# Altium schematic sheet POWER_NODE.SchDoc
size A3; SheetNumber: 3; SheetTotal: 3
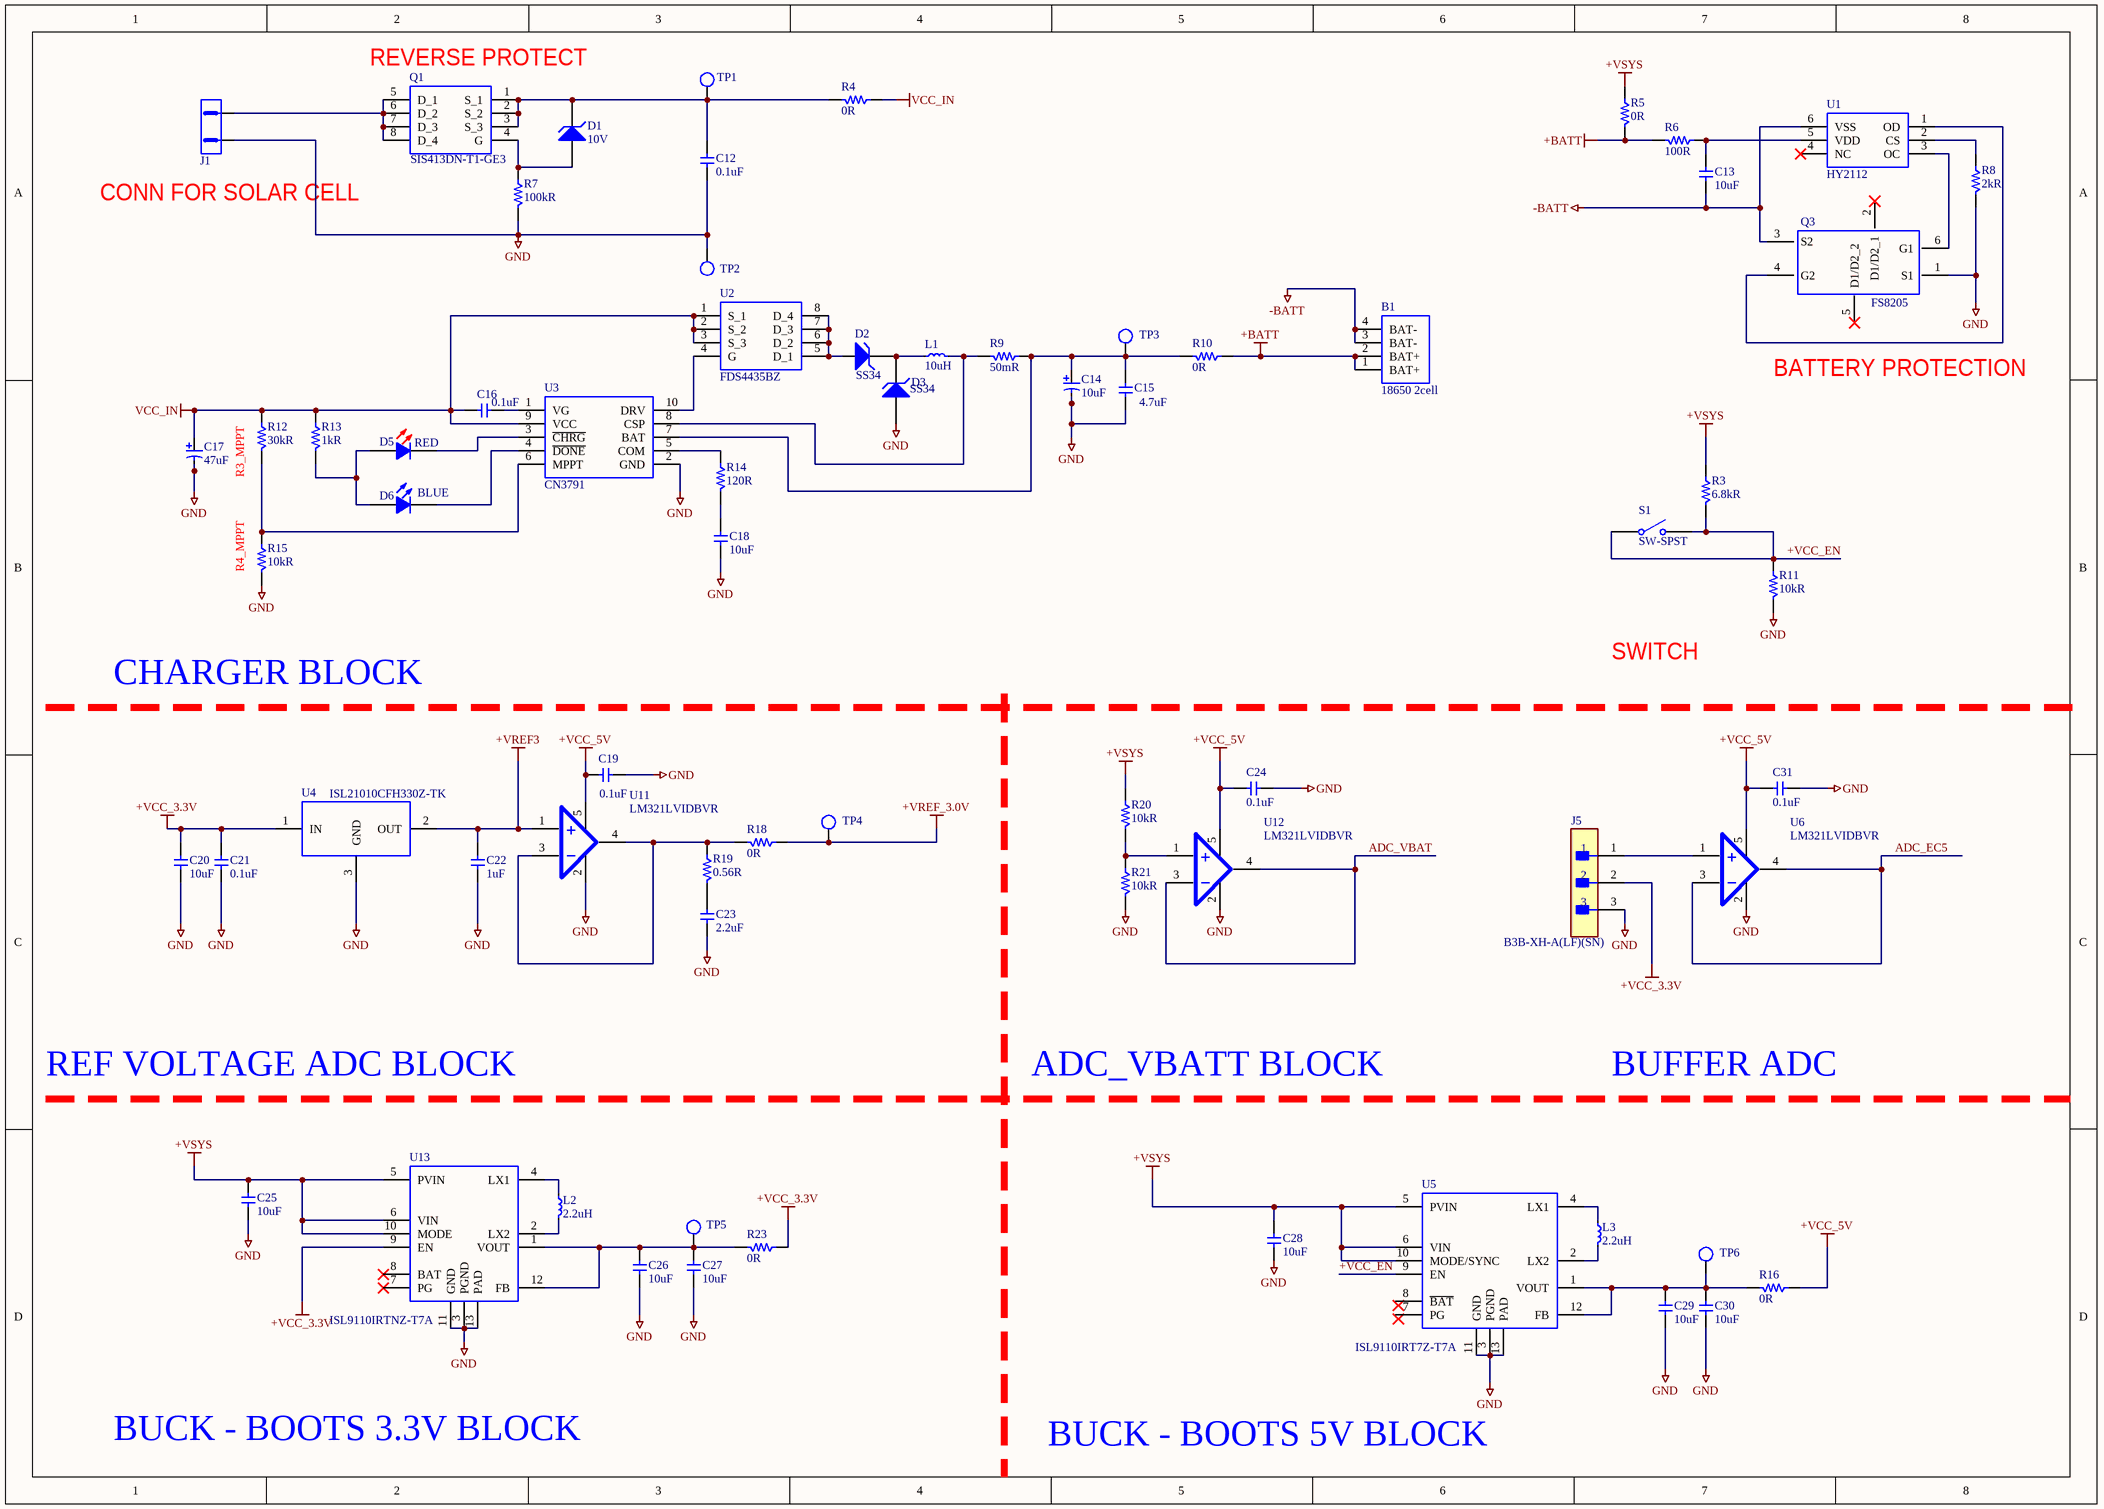
[diagram p0: POWER_NODE.SchDoc]

## Parts
B1  18650 2cell  [18650 2CELL]
C12  0.1uF  [CAP 0402 (1005)]
C13  10uF  [CAP 0603 (1608)]
C14  10uF  [CAP 1206 TANTALUM]
C15  4.7uF  [CAP 0402 (1005)]
C16  0.1uF  [CAP 0402 (1005)]
C17  47uF  [CAP ALUMIUM 47uF]
C18  10uF  [CAP 0603 (1608)]
C19  0.1uF  [CAP 0402 (1005)]
C20  10uF  [CAP 0603 (1608)]
C21  0.1uF  [CAP 0402 (1005)]
C22  1uF  [CAP 0402 (1005)]
C23  2.2uF  [CAP 0402 (1005)]
C24  0.1uF  [CAP 0402 (1005)]
C25  10uF  [CAP 0603 (1608)]
C26  10uF  [CAP 0603 (1608)]
C27  10uF  [CAP 0603 (1608)]
C28  10uF  [CAP 0603 (1608)]
C29  10uF  [CAP 0603 (1608)]
C30  10uF  [CAP 0603 (1608)]
C31  0.1uF  [CAP 0402 (1005)]
D1  10V  [SOT-323]
D2  SS34  [DIOM8059X256N]
D3  SS34  [DIOM8059X256N]
D5  RED  [LED 0402 RED]
D6  BLUE  [LED0402 BLUE]
J1  CONN  [HEADER 2P 2.54MM ANGLE RIGHT]  (value not drawn)
J5  B3B-XH-A(LF)(SN)  [FP-B3B-XH-A_LF_SN-MFG]
L1  10uH  [IND 10uH 4x4x2mm]
L2  2.2uH  [IND 4028]
L3  2.2uH  [IND 4028]
Q1  SIS413DN-T1-GE3  [SIS862DNT1GE3]
Q3  FS8205  [SOT95P280X125-6N]
R3  6.8kR  [RES 0402 (1005)]
R4  0R  [RES 0603 (1608)]
R5  0R  [RES 0603 (1608)]
R6  100R  [RES 0402 (1005)]
R7  100kR  [RES 0402 (1005)]
R8  2kR  [RES 0402 (1005)]
R9  50mR  [RES 0805 (2012)]
R10  0R  [RES 0603 (1608)]
R11  10kR  [RES 0402 (1005)]
R12  30kR  [RES 0402 (1005)]
R13  1kR  [RES 0402 (1005)]
R14  120R  [RES 0402 (1005)]
R15  10kR  [RES 0402 (1005)]
R16  0R  [RES 0603 (1608)]
R18  0R  [RES 0402 (1005)]
R19  0.56R  [RES 0402 (1005)]
R20  10kR  [RES 0402 (1005)]
R21  10kR  [RES 0402 (1005)]
R23  0R  [RES 0603 (1608)]
S1  SW-SPST  [SW_SS12D07VG4]
TP1  TEST POINT  [TEST POINT]  (value not drawn)
TP2  TEST POINT  [TEST POINT]  (value not drawn)
TP3  TEST POINT  [TEST POINT]  (value not drawn)
TP4  TEST POINT  [TEST POINT]  (value not drawn)
TP5  TEST POINT  [TEST POINT]  (value not drawn)
TP6  TEST POINT  [TEST POINT]  (value not drawn)
U1  HY2112  [SOT95P280X140-6N]
U2  FDS4435BZ  [SOIC127P600X175-8N]
U3  CN3791  [SOP100P600X175-10N]
U4  ISL21010CFH330Z-TK  [SOT-23-3]
U5  ISL9110IRT7Z-T7A  [12-WFDFN EXPOSED PAD]
U6  LM321LVIDBVR  [SOT-23-5]
U11  LM321LVIDBVR  [SOT-23-5]
U12  LM321LVIDBVR  [SOT-23-5]
U13  ISL9110IRTNZ-T7A  [12-WFDFN EXPOSED PAD]

## Nets
+BATT: B1.1(BAT+) B1.2(BAT+) R5.1 R6.1 R10.2
+VCC_3.3V: C20.1 C21.1 J5.2 R23.2 U4.1(IN) U13.9(EN)
+VCC_5V: C19.1 C24.1 C31.1 R16.2 U6.5 U11.5 U12.5
+VREF3: C22.1 U4.2(OUT) U11.1
+VREF_3.0V: R18.2 TP4.1
+VSYS: C25.1 C28.1 R3.2 R5.2 R20.2 U5.5(PVIN) U5.6(VIN) U5.10(MODE/SYNC) U13.5(PVIN) U13.6(VIN) U13.10(MODE)
-BATT: B1.3(BAT-) B1.4(BAT-) C13.2 Q3.3(S2) U1.6(VSS)
GND: C12.2 C14.2(-) C15.2 C17.2(-) C18.2 C19.2 C20.2 C21.2 C22.2 C23.2 C24.2 C25.2 C26.2 C27.2 C28.2 C29.2 C30.2 C31.2 D3.2(A) J1.2 J5.3 Q3.1(S1) R7.1 R8.1 R11.1 R15.1 R21.1 TP2.1 U3.2(GND) U4.3(GND) U5.3(PGND) U5.11(GND) U5.13(PAD) U6.2 U11.2 U12.2 U13.3(PGND) U13.11(GND) U13.13(PAD)
VCC_IN: C16.2 C17.1(+) R4.2 R12.2 R13.2 U2.1(S_1) U2.2(S_2) U2.3(S_3) U3.9(VCC)
+VCC_EN: R3.1 R11.2 S1.1(COMMON) S1.2(NO) U5.9(EN)
ADC_EC5: U6.3 U6.4
ADC_VBAT: U12.3 U12.4
NetC12_1: C12.1 D1.1(K) Q1.1(S_1) Q1.2(S_2) Q1.3(S_3) R4.1 TP1.1
NetC13_1: C13.1 R6.2 U1.5(VDD)
NetC14_1: C14.1(+) C15.1 R9.2 R10.1 TP3.1 U3.7(BAT)
NetC16_1: C16.1 U3.1(VG)
NetC18_1: C18.1 R14.1
NetC23_1: C23.1 R19.1
NetC26_1: C26.1 C27.1 R23.1 TP5.1 U13.1(VOUT) U13.12(FB)
NetC29_1: C29.1 C30.1 R16.1 TP6.1 U5.1(VOUT) U5.12(FB)
NetD1_2: D1.2(A) Q1.4(G) R7.2
NetD2_1: D2.1(K) D3.1(K) L1.1
NetD2_2: D2.2(A) U2.5(D_1) U2.6(D_2) U2.7(D_3) U2.8(D_4)
NetD5_1: D5.1(A) D6.1(A) R13.1
NetD5_2: D5.2(K) U3.3(~{CHRG})
NetD6_2: D6.2(K) U3.4(~{DONE})
NetJ1_1: J1.1 Q1.5(D_1) Q1.6(D_2) Q1.7(D_3) Q1.8(D_4)
NetJ5_1: J5.1 U6.1
NetL1_2: L1.2 R9.1 U3.8(CSP)
NetL2_1: L2.1 U13.4(LX1)
NetL2_2: L2.2 U13.2(LX2)
NetL3_1: L3.1 U5.4(LX1)
NetL3_2: L3.2 U5.2(LX2)
NetQ3_4: Q3.4(G2) U1.1(OD)
NetQ3_6: Q3.6(G1) U1.3(OC)
NetR8_2: R8.2 U1.2(CS)
NetR12_1: R12.1 R15.2 U3.6(MPPT)
NetR14_2: R14.2 U3.5(COM)
NetR18_1: R18.1 R19.2 U11.3 U11.4
NetR20_1: R20.1 R21.2 U12.1
NetU2_4: U2.4(G) U3.10(DRV)

Not connected (* = marked no-connect by the designer): Q3 2(D1/D2_1)* 5(D1/D2_2)*; U1 4(NC)*; U5 7(PG) 8(~{BAT}); U13 7(PG)* 8(BAT)*

## Notes on the sheet
- (near Q1) REVERSE PROTECT
- (near J1) CONN FOR SOLAR CELL
- BATTERY PROTECTION
- (near R12) R3_MPPT
- (near R15) R4_MPPT
- CHARGER BLOCK
- SWITCH
- REF VOLTAGE ADC BLOCK
- ADC_VBATT BLOCK
- BUFFER ADC
- BUCK - BOOTS 3.3V BLOCK
- BUCK - BOOTS 5V BLOCK

## Library data of the parts
B1 = 18650 2CELL: BATTERY HOLDER; Manufacturer: CXT; Manufacturer Part Number: T220213; Supplier: CXT; Unit Price: 9.000VND
C12 C16 C19 C21 C24 C31 = CAP0402 0.1uF 50V: 50V 100nF ±10% 0402 Multilayer Ceramic Capacitors MLCC - SMD/SMT ROHS; Manufacturer: Samwha Capacitor; Manufacturer Part Number: CS1005X7R104K500NR; Supplier: LCSC electronics; Unit Price: $0.0017
C13 C18 C20 C25-C30 = CAP0603 10uF 25V: 25V 10uF X5R ±20% 0603 Multilayer Ceramic Capacitors MLCC - SMD/SMT ROHS; Manufacturer: Chinocera; Manufacturer Part Number: HGC0603R5106M250NTHJ; Supplier: LCSC electronics; Unit Price: $0.0199
C14 = CAP1206 TANTALUM 10uF: 10uF 20V 150mΩ@100kHz ±20% 1206 Tantalum Capacitors ROHS; Manufacturer: Kyocera AVX; Manufacturer Part Number: TCJA106M020R0150; Supplier: LCSC electronics; Unit Price: $0.4964
C15 = CAP0402 4.7uF 25V: 25V 4.7uF X5R 0402 Multilayer Ceramic Capacitors MLCC - SMD/SMT ROHS; Manufacturer: Murata Electronics; Manufacturer Part Number: GRM155R61E475ME15D; Supplier: LCSC electronics; Unit Price: $0.0433
C17 = CAP ALUMI 47uF 16V: 47uF 16V 31mA@120Hz ±20% SMD,D5xL5.4mm Aluminum Electrolytic Capacitors - SMD ROHS; Manufacturer: KNSCHA; Manufacturer Part Number: RST47UF16V034; Supplier: LCSC electronics; Unit Price: $0.0250
C22 = CAP0402 1uF 25V: 25V 1uF ±10% 0402 Multilayer Ceramic Capacitors MLCC - SMD/SMT ROHS; Manufacturer: FH (Guangdong Fenghua Advanced Tech); Manufacturer Part Number: 0402X105K250NT; Supplier: LCSC electronics; Unit Price: US$ 0.0044
C23 = CAP0402 2.2uF 25V: 25V 2.2uF ±20% 0402 Multilayer Ceramic Capacitors MLCC - SMD/SMT ROHS; Manufacturer: SANYEAR; Manufacturer Part Number: C0402X5R225M250NT; Supplier: LCSC electronics; Unit Price: $0.0166
D1 = BAT60B: Schottky Diode10V Single 600mV@1A 3A SOD-323 Schottky Barrier Diodes (SBD) ROHS; Manufacturer: High Diode; Manufacturer Part Number: BAT60B; Supplier: LCSC electronics; Unit Price: $0.0317
D2 D3 = SS34: 40V Single 0.55V@3.0A 3A SMA Schottky Barrier Diodes (SBD) ROHS; Manufacturer: onsemi; Manufacturer Part Number: SS34; Supplier: LCSC electronics; Unit Price: $0.0242
D5 = LED RED 0402: Red 0402 Light Emitting Diodes (LED) ROHS; Manufacturer: BrtLed(Bright LED Elec); Manufacturer Part Number: BL-HUB37A-AV-TRB; Supplier: LCSD electronics; Unit Price: $0.0171
D6 = LED BLUE 0402: blue 0402 Light Emitting Diodes (LED) ROHS; Manufacturer: BrtLed(Bright LED Elec); Manufacturer Part Number: BL-HB337A-AV-TRB; Supplier: LCSD electronics; Unit Price: $0.0178
J1 = CONN 2P 2.54mm THANG: 1x2P 1 XH/EH Tinning 2.54mm 2.54mm Female 2 -25℃~+85℃ Brass 3A Plug-in Plugin,P=2.5mm Wire To Board / Wire To Wire Connector ROHS; Manufacturer: SHOU HAN; Manufacturer Part Number: 2.54mm-2P ZZ; Supplier: LCSD electronics; Unit Price: $0.0069
J5 = CMP-17439-000014-3: CONN HEADER VERT 3POS 2.5MM; Max Voltage Rating (DC): 250V; Number of Positions: 3; Current Rating: 3A; Gender: Male; Wire/Cable Gauge: 22AWG; Contact Resistance: 20mR; Insulation Resistance: 1GR; Insulation Material: Nylon; Contact Plating: Tin; Depth: 5.75mm; Contact Type: Male Pin; Max Operating Temperature: 85°C; Insulation Color: Natural; Voltage Rating (AC): 250V; Color: Natural; Connector Type: Header; Orientation: Straight; Fastening Type: Detent; Housing Color: White; Min Operating Temperature: -25°C; Termination: Solder; Voltage Rating: 250V; Series: XH; Pitch: 2.5mm; Contact Shape: Square; Number of Rows: 1; Lead Free: Lead Free; Packaging: Bulk; Mount: Through Hole; Flammability Rating: UL94 V-0; Max Voltage Rating (AC): 250V; REACH SVHC: No SVHC; Housing Material: Polyamide; Contact Material: Brass; Lead Pitch: 2.5mm; Contact Finish - Mating: TIN; Length: 9.9mm; Max Current Rating: 3A; Number of Contacts: 3
L1 = IND 10uH: 10uH ±20% SMD,4x4x2mm Power Inductors ROHS; Manufacturer: SXN(Shun Xiang Nuo Elec); Manufacturer Part Number: SMNR4020-10UH; Supplier: LCSC electronics; Unit Price: $0.0639
L2 L3 = IND 2.2uH: 2.2uH Magnetic inductor 20% 1.22A SMD,3x3mm Power Inductors ROHS; Manufacturer: APV; Manufacturer Part Number: ANR3012T2R2M; Supplier: LCSC electronics; Unit Price: $0.0390
Q1 = SIS413DN-T1-GE3: MOSFET (P-Channel); Manufacturer: Vishay; Supplier: Digikey; Manufacturer Part Number: SIS413DN-T1-GE3; Unit Price: $0.57
Q3 = FET 2N FS8205: 20V 6A 28mΩ@4.5V,4A 1W 2 N-Channel SOT-23-6 MOSFETs ROHS; Manufacturer: Fortune Semicon; Manufacturer Part Number: FS8205; Supplier: LCSD electronics; Unit Price: $0.1805
R3 = RES0402 6.8kR 1%: ±1% 6.8kΩ 0402 Chip Resistor - Surface Mount ROHS; Manufacturer: VO; Manufacturer Part Number: SCR0402F6K8; Supplier: LCSC electronics; Unit Price: $0.0005
R4 R5 R10 R16 R23 = RES0603 0R: 0Ω 0603 Chip Resistor - Surface Mount ROHS; Manufacturer: KOA Speer Elec; Manufacturer Part Number: RK73Z1JTTD; Supplier: LCSC electronics; Unit Price: $0.0048
R6 = RES0402 100R 1%: ±1% 100Ω 0402 Chip Resistor - Surface Mount ROHS; Manufacturer: VO; Manufacturer Part Number: SCR0402F100R; Supplier: LCSC electronics; Unit Price: $0.0005
R7 = RES0402 100k 1%: ±1% 100kΩ 0402 Chip Resistor - Surface Mount ROHS; Manufacturer: VO; Manufacturer Part Number: SCR0402F100K; Supplier: LCSC electronics; Unit Price: $0.0005
R8 = RES0402 2kR 1%: ±1% 2kΩ 0402 Chip Resistor - Surface Mount ROHS; Manufacturer: VO; Manufacturer Part Number: SCR0402F2K; Supplier: LCSC electronics; Unit Price: $0.0005
R9 = RES0805 50mR Current Sense: 50mΩ ±1% 0805 Current Sense Resistors/Shunt Resistors ROHS; Manufacturer: TA-I Tech; Manufacturer Part Number: RL10FTNR050; Supplier: LCSC electronics; Unit Price: $0.0152
R11 = RES0402 10kR 1%: ±1% 10kΩ 0402 Chip Resistor - Surface Mount ROHS; Manufacturer: VO; Manufacturer Part Number: SCR0402F10K; Supplier: LCSC electronics; Unit Price: $0.0005
R12 = RES0402 47kR 1%: ±1% 47kΩ 0402 Chip Resistor - Surface Mount ROHS; Manufacturer: VO; Manufacturer Part Number: SCR0402F47K; Supplier: LCSC electronics; Unit Price: $0.0005
R13 = RES0402 1kR 1%: ±5% 1kΩ 0402 Chip Resistor - Surface Mount ROHS; Manufacturer: VO; Manufacturer Part Number: SCR0402J1K; Supplier: LCSC electronics; Unit Price: $0.0004
R14 = RES0402 120R 1%: ±1% 120Ω 0402 Chip Resistor - Surface Mount ROHS; Manufacturer: VO; Manufacturer Part Number: SCR0402F120R; Supplier: LCSC electronics; Unit Price: $0.0005
R15 = RES0402 12kR 1%: ±1% 12kΩ 0402 Chip Resistor - Surface Mount ROHS; Manufacturer: VO; Manufacturer Part Number: SCR0402F12K; Supplier: LCSC electronics; Unit Price: $0.0005
R18 = RES0402 0R: 0Ω 0402 Chip Resistor - Surface Mount ROHS; Manufacturer: KOA Speer Elec; Manufacturer Part Number: RK73Z1ETTP; Supplier: LCSC electronics; Unit Price: $0.0072
R19 = RES0402 0.56R 5%: ±5% 560mΩ 0402 Chip Resistor - Surface Mount ROHS; Manufacturer: VO; Manufacturer Part Number: SCR0402JR560; Supplier: LCSC electronics; Unit Price: $0.0027
R20 R21 = RES0402 10kR 1%: 200mW Thick Film Resistors ±100ppm/℃ ±1% 10kΩ 0402 Chip Resistor - Surface Mount ROHS; Manufacturer: Vishay Intertech; Manufacturer Part Number: RCS040210K0FKED; Supplier: LCSC electronics; Unit Price: $0.0127
S1 = SW-SPST: Single-Pole, Single-Throw Switch; Published: 24-Mar-1999; LatestRevisionDate: 17-Jul-2002; LatestRevisionNote: Re-released for DXP Platform.; PackageReference: SPST-2; Publisher: Altium Limited; PackageDescription: Switch; 2 Leads
U1 = HY2112: SOT-23-6 Battery Management ICs ROHS; Manufacturer: HYCON Tech; Manufacturer Part Number: HY2112; Supplier: LCSD electronics; Unit Price: $0.1053
U2 = FDS4435BZ: SOT-23-6 Battery Management ICs ROHS; Manufacturer: HYCON Tech; Manufacturer Part Number: HY2112-BB; Supplier: LCSD electronics; Unit Price: $0.1053
U3 = IC CN3791: SOP-10-1mm Battery Management ICs ROHS; Manufacturer: ShangHai Consonance Elec; Manufacturer Part Number: CN3791; Supplier: LCSD electronics; Unit Price: $0.5664
U4 = IC ISL21010CFH330Z-TK: Series Voltage Reference IC Fixed 3V V ±0.2% 25 mA SOT-23-3; Manufacturer: Renesas Electronics America Inc; Manufacturer Part Number: ISL21010CFH330Z-TK; Supplier: Digikey; Unit Price: $2.9
U5 = IC ISL9110IRT7Z-T7A: Buck-Boost Switching Regulator IC Positive Fixed 5V 1 Output 1.2A 12-WFDFN Exposed Pad; Manufacturer: Renesas Electronics America Inc; Manufacturer Part Number: ISL9110IRT7Z-T7A; Supplier: Digikey; Unit Price: $3.1
U6 U11 U12 = IC LM321LVIDBVR: General Purpose Amplifier 1 Circuit SOT-23-5; Manufacturer: Texas Instruments; Manufacturer Part Number: LM321LVIDBVR; Supplier: Digikey; Unit price: $0.26
U13 = IC ISL9110IRTNZ-T7A: Buck-Boost Switching Regulator IC Positive Fixed 3.3V 1 Output 1.2A 12-WFDFN Exposed Pad; Manufacturer: Renesas Electronics America Inc; Manufacturer Part Number: ISL9110IRTNZ-T7A; Supplier: Digikey; Unit Price: $3.1